# Altium schematic sheet power supply.SchDoc
size A3; SheetNumber: 1; SheetTotal: 5
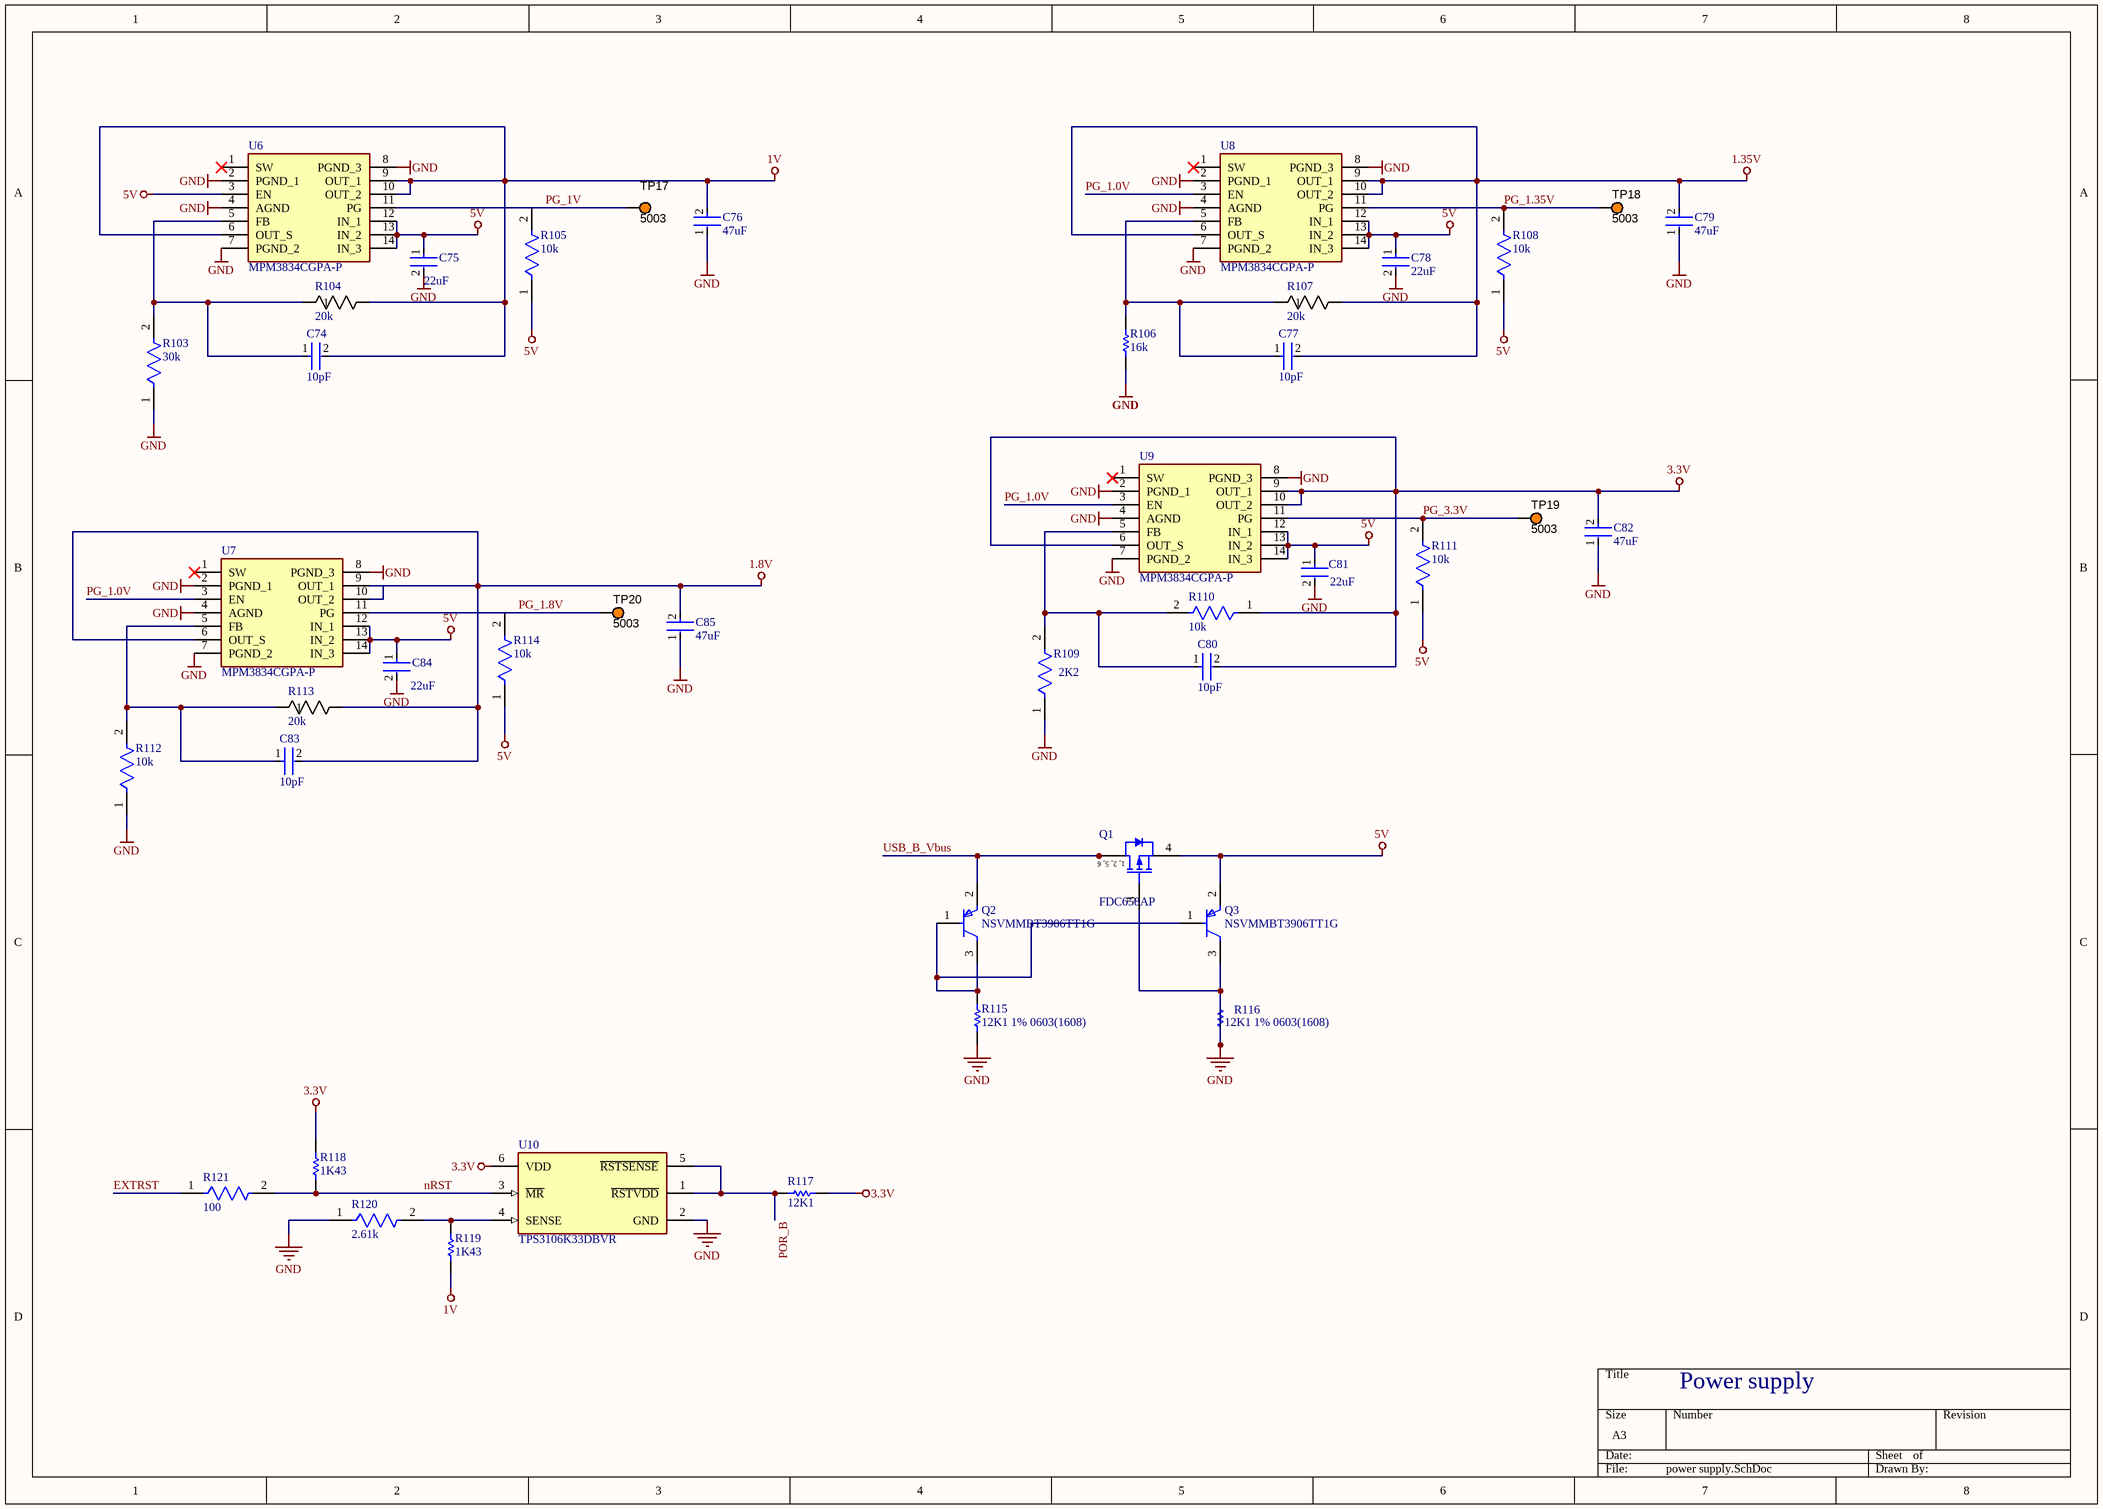
[diagram p0: power supply.SchDoc]

## Parts
C74  10pF  [FP-0603-L_1_6_0_15-W_0_81-IPC_B]
C75  22uF  [FP-GRMJN7-0_1-IPC_C]
C76  47uF  [FP-GRM31C-0_3-e0_3_0_8-IPC_C]
C77  10pF  [FP-0603-L_1_6_0_15-W_0_81-IPC_B]
C78  22uF  [FP-GRMJN7-0_1-IPC_C]
C79  47uF  [FP-GRM31C-0_3-e0_3_0_8-IPC_C]
C80  10pF  [FP-0603-L_1_6_0_15-W_0_81-IPC_B]
C81  22uF  [FP-GRMJN7-0_1-IPC_C]
C82  47uF  [FP-GRM31C-0_3-e0_3_0_8-IPC_C]
C83  10pF  [FP-0603-L_1_6_0_15-W_0_81-IPC_B]
C84  22uF  [FP-GRMJN7-0_1-IPC_C]
C85  47uF  [FP-GRM31C-0_3-e0_3_0_8-IPC_C]
Q1  FDC658AP  [FAIR-SOT23-6_V]
Q2  NSVMMBT3906TT1G  [FP-463-01-MFG]
Q3  NSVMMBT3906TT1G  [FP-463-01-MFG]
R103  30k  [FP-RMCF0603-IPC_A]
R104  20k  [RES_RCC0402_VIS]
R105  10k  [FP-RN73R2A-IPC_A]
R106  16k  [RESC0603X28X15LL05T05]
R107  20k  [RES_RCC0402_VIS]
R108  10k  [FP-RN73R2A-IPC_A]
R109  2K2  [FP-LTR10-IPC_B]
R110  10k  [FP-RN73R2A-IPC_A]
R111  10k  [FP-RN73R2A-IPC_A]
R112  10k  [FP-RN73R2A-IPC_A]
R113  20k  [RES_RCC0402_VIS]
R114  10k  [FP-RN73R2A-IPC_A]
R115  12K1 1% 0603(1608)  [RESC0603(1608)_M]
R116  12K1 1% 0603(1608)  [RESC0603(1608)_M]
R117  12K1  [RESC0603(1608)_M]
R118  1K43  [RESC1206(3216)_M]
R119  1K43  [RESC1206(3216)_M]
R120  2.61k  [FP-RK73H1J-IPC_B]
R121  100  [FP-RMCF0805-IPC_A]
TP17  5003  [KSTN-5003]
TP18  5003  [KSTN-5003]
TP19  5003  [KSTN-5003]
TP20  5003  [KSTN-5003]
U6  MPM3834CGPA-P  [MPM3834CGPAP]
U7  MPM3834CGPA-P  [MPM3834CGPAP]
U8  MPM3834CGPA-P  [MPM3834CGPAP]
U9  MPM3834CGPA-P  [MPM3834CGPAP]
U10  TPS3106K33DBVR  [FP-DBV0006A-MFG]

## Nets
1.8V: C83.2 C85.2 R113.2 U7.6(OUT_S) U7.9(OUT_1) U7.10(OUT_2)
1.35V: C77.2 C79.2 R107.2 U8.6(OUT_S) U8.9(OUT_1) U8.10(OUT_2)
1V: C74.2 C76.2 R104.2 R119.1 U6.6(OUT_S) U6.9(OUT_1) U6.10(OUT_2)
3.3V: C80.2 C82.2 R110.1 R117.1 R118.2 U9.6(OUT_S) U9.9(OUT_1) U9.10(OUT_2) U10.6(VDD)
5V: C75.1 C78.1 C81.1 C84.1 Q1.4(SOURCE) Q3.2(E) R105.1 R108.1 R111.1 R114.1 U6.3(EN) U6.12(IN_1) U6.13(IN_2) U6.14(IN_3) U7.12(IN_1) U7.13(IN_2) U7.14(IN_3) U8.12(IN_1) U8.13(IN_2) U8.14(IN_3) U9.12(IN_1) U9.13(IN_2) U9.14(IN_3)
GND: C75.2 C76.1 C78.2 C79.1 C81.2 C82.1 C84.2 C85.1 Q1.3(GATE) Q3.3(C) R103.1 R106.1 R109.1 R112.1 R115.1 R116.1 R116.2 R120.1 U6.2(PGND_1) U6.4(AGND) U6.7(PGND_2) U6.8(PGND_3) U7.2(PGND_1) U7.4(AGND) U7.7(PGND_2) U7.8(PGND_3) U8.2(PGND_1) U8.4(AGND) U8.7(PGND_2) U8.8(PGND_3) U9.2(PGND_1) U9.4(AGND) U9.7(PGND_2) U9.8(PGND_3) U10.2(GND)
EXTRST: R121.1
nRST: R118.1 R121.2 U10.3(~{MR})
PG_1.0V: U7.3(EN) U8.3(EN) U9.3(EN)
PG_1.8V: R114.2 TP20.1 U7.11(PG)
PG_1.35V: R108.2 TP18.1 U8.11(PG)
PG_1V: R105.2 TP17.1 U6.11(PG)
PG_3.3V: R111.2 TP19.1 U9.11(PG)
POR_B: R117.2 U10.1(~{RSTVDD}) U10.5(~{RSTSENSE})
USB_B_Vbus: Q1.1(DRAIN) Q1.2(DRAIN) Q1.5(DRAIN) Q1.6(DRAIN) Q2.2(E)
NetC74_1: C74.1 R103.2 R104.1 U6.5(FB)
NetC77_1: C77.1 R106.2 R107.1 U8.5(FB)
NetC80_1: C80.1 R109.2 R110.2 U9.5(FB)
NetC83_1: C83.1 R112.2 R113.1 U7.5(FB)
NetQ2_1: Q2.1(B) Q2.3(C) Q3.1(B) R115.2
NetR119_2: R119.2 R120.2 U10.4(SENSE)

Not connected (* = marked no-connect by the designer): U6 1(SW)*; U7 1(SW)*; U8 1(SW)*; U9 1(SW)*

## Notes on the sheet
- Power supply
- (in symbol CMP-2000-06244-1) 1, 2, 5, 6

## Library data of the parts
C74 C77 C80 C83 = CMP-04427-018082-1: General Purpose Ceramic Capacitor, 0603, 10pF, 2%, NP0, 30ppm/°C, 100V; Dielectric: C0G; Package Quantity: 1; Case/Package: 0603; Mount: Surface Mount; Length: 0.063inch; Voltage Rating (DC): 100V; Lead Free: Lead Free; Termination: SMD/SMT; Thickness: 0.035inch; Capacitance: 10pF; Voltage Rating: 100V; Tolerance: 2%; Case Code (Metric): 1608; Max Operating Temperature: 125°C; Height: 860um; Width: 0.032inch; Case Code (Imperial): 0603; Min Operating Temperature: -55°C; Construction: Flat; Number of Pins: 2; Series: -; Packaging: Tape and Reel; RoHS Compliant: Yes
C75 C78 C81 C84 = CMP-06035-032253-1: Chip Multilayer Ceramic Capacitors for General Purpose, 0704, 22uF, X5R, 15%, 20%, 16V
C76 C79 C82 C85 = CMP-06035-011430-1: Chip Multilayer Ceramic Capacitors for General Purpose, 1206, 47uF, X5R, 15%, 20%, 16V; Capacitance: 47uF; Length: 3.2mm; Thickness: 1.6mm; Width: 1.6mm; Voltage Rating (DC): 16V; Tolerance: 20%; Dielectric: X5R
Q1 = CMP-2000-06244-1: Single P-Channel Logic Level PowerTrench(R) MOSFET, -30 V, -4 A, -55 to 150 degC, 6-Pin SOT23, RoHS, Tape and Reel; Manufacturer: Fairchild Semiconductor; Drain-to-Source Voltage [Vdss]: 30V; Qg Gate Charge: 8.1nC; Rated Power Dissipation: 0.8W; Package Version: Rev. 5, 05/2015; Drain-Source On Resistance-Max: 50mO; Datasheet Version: Rev. B1, 11/2011; Channel Type: P-Channel; Package URL: https://www.fairchildsemi.com/package-drawings/MA/MA06A.pdf; Datasheet URL: https://datasheet.ciiva.com/15137/getdatasheetpartid-92299-15137737.pdf; Package Description: 6-Pin Small Outline Transistor, Body 2.9 x 1.6 mm, Pitch 0.95 mm; Mounting Technology: SurfaceMount; Manufacturer URL: https://www.fairchildsemi.com/; Package Reference: SOT23-6
Q2 Q3 = CMP-00278-57605538-1: NSVMMBT3906TT1G Small Signal Bipolar Transistor, 0.2A I(C), 40V V(BR)CEO, 1-Element, PNP, Silicon; Manufacturer Lifecycle Status: ACTIVE; Collector Emitter Voltage (VCEO): 400mV; Transition Frequency: 250MHz; Max Collector Current: 200mA; Max Power Dissipation: 200mW; NexarPartId: 57605538; Packaging: Tape & Reel (TR); Lead Free: Lead Free; Lifecycle Status: Production; Collector Emitter Breakdown Voltage: 40V; Mount: Surface Mount; RoHS: Compliant
R103 = CMP-26527-002251-1: 30kΩ ±5% 0.1W 0603 Thick Film Chip Resistor AEC-Q200 compliant; Max Power Dissipation: 100mW; Temperature Coefficient: 200ppm/°C; Resistance: 30kR; Width: 0.031inch; Series: RMCF; Resistor Type: Thick Film; Number of Terminations: 2; Max Operating Temperature: 155°C; Length: 0.061inch; Contact Plating: Tin; Case/Package: 0603; Height: 0.022inch; Tolerance: 5%; Min Operating Temperature: -55°C; Mount: Surface Mount; Packaging: Tape and Reel; RoHS Compliant: Yes; Features: Automotive AEC-Q200; Radiation Hardening: No
R104 R107 R113 = CMP-05494-108190669-1: RCC040220K0FKED Res Thick Film 0402 20K Ohm 1% 0.125W(1/8W) ±100ppm/°C Pad SMD Automotive T/R; Schedule B: 8533210045; NexarPartId: 108190669
R105 R108 R110-R112 R114 = CMP-04015-052084-1: RES 10K OHM 0.1% 1/8W 0805
R106 = CMP-2004-00154-1: Part Number: CRCW020116K0JNED; Manufacturer: Vishay Dale
R109 = CMP-08839-030356-1: High power chip resistors wide terminal type 2.2kΩ 5% 0.25W 0508; Max Power Dissipation: 250mW; Resistance: 2.2kR; Temperature Coefficient: 200ppm/°C; Tolerance: 5%; Series: LTR; Height: 0.026inch; Case Code (Metric): 2012; Features: Automotive AEC-Q200; Max Operating Temperature: 155°C; Packaging: Tape and Reel; Min Operating Temperature: -55°C; Case/Package: 0805; Resistor Type: Thick Film; Number of Terminations: 2; Width: 0.079inch; Length: 0.047inch; Case Code (Imperial): 0805; Package Quantity: 1
R115-R117 = CMP-1012-00632-1: 12K1 0.1W 1% 0603 (1608 Metric)  SMD; Case-Metric: 1608; Case-EIA: 0603; Value: 12100.00 Ohm; Power: 0.1 W; Technology: SMT; Tolerance: 1 %
R118 R119 = CMP-1014-00526-1: 1K43 0.25W 1% 1206 (3216 Metric)  SMD; Value: 1430.00 Ohm; Case-EIA: 1206; Case-Metric: 3216; Power: 0.25 W; Technology: SMT; Tolerance: 1 %
R120 = CMP-04015-095862-1: 2.61kΩ ±0.5% 0.1W Chip Resistor 0603 Thick Film AEC-Q200 Qualified
R121 = CMP-26527-001731-1: 100Ω ±1% 0.125W 0805 Thick Film Chip Resistor AEC-Q200 compliant; Power Rating: 250mW; Temperature Coefficient: 100ppm/°C; Resistance: 100R; Max Power Dissipation: 125mW; Radiation Hardening: No; RoHS Compliant: Yes; Case Code (Imperial): 0805; Depth: 1.25mm; Length: 2mm; Min Operating Temperature: -55°C; Series: RMCF; Packaging: Tape and Reel; Features: Automotive AEC-Q200; Height: 0.026inch; Size Code: 0805; Tolerance: 1%; Number of Terminations: 2; Max Operating Temperature: 155°C; Case/Package: 0805; Width: 0.049inch; Contact Plating: Tin; Resistor Type: Thick Film; Construction: Rectangular; Lead Free: Lead Free; Military Standard: Not; Case Code (Metric): 2012; Mount: Surface Mount
TP17-TP20 = CMP-1672-00009-1: Test Point, Orange, 1-Pin THD, RoHS; Peak Reverse Current: 600 uA; Forward Current: 3 A; Max Surge Current: 80 A; Forward Voltage: 1.08 V; Max Operating Temperature: 150 degC; PackageReference: 5003; Pins: 2; ComponentLink2URL: http://keyelco.com/userAssets/file/M65p56.pdf; PackageDescription: 1-Pin Through Hole Device, Dia 2.54 mm; Weight: 0.01 lb; Diameter: 5.3 mm; Mount: Through Hole; Package Quantity: 500; Packaging: Bulk; Min Operating Temperature: -65 degC; ComponentLink1Description: Manufacturer URL; Height: 0.25 inch; ComponentLink1URL: http://www.keyelco.com/; ComponentLink2Description: Datasheet; Width: 0.25 inch; REACH SVHC: No SVHC; RoHSCompliant: true; Radiation Hardening: No; Length: 9.5 mm; DatasheetVersion: Jun-15
U6-U9 = MPM3834CGPA-P: Integrated Circuit; Manufacturer_Name: Monolithic Power Systems (MPS); Datasheet Link: https://www.monolithicpower.com/en/documentview/productdocument/index/version/2/document_type/Datasheet/lang/en/sku/MPM3834CGPA/document_id/9651/; Height: 1.31mm; Manufacturer_Part_Number: MPM3834CGPA-P; Mouser Part Number: 946-MPM3834CGPA-P; Mouser Price/Stock: https://www.mouser.co.uk/ProductDetail/Monolithic-Power-Systems-MPS/MPM3834CGPA-P?qs=By6Nw2ByBD1gcNTTHPVSOg%3D%3D
U10 = CMP-04919-000013-1: IC SUPERVISORY CIRCUIT SOT-23-6; Manufacturer: Texas Instruments; Min Supply Voltage: 0.9V; Reset Type: Active Low; Max Junction Temp: +125°C; Reset Timeout: 130ms; Number Of Rails Monitored: 1; Threshold Voltage: 2.941V; Nominal Supply Current: 1.2-2uA; Standoff Height: 0mm; Max Supply Voltage: 3.6V; Number Of Outputs: 2; Temperature Range High: +85°C; Device Class L1: Integrated Circuits (ICs); Device Class L3: Voltage Supervisors; Automotive: No; Mouser Description: Supervisory Circuits Current/Supply-Volt Supervisory; Temperature: -40°C to +85°C; Lead Free: Yes; Height: 1.45mm; Category: IC; Octopart: https://octopart.com/tps3106k33dbvr-texas+instruments-505820; Device Class L2: Power Management ICs; RoHS: TRUE; Package: DBV0006A; ComponentLink2Description: Datasheet; ComponentLink2URL: http://www.ti.com/lit/ds/symlink/tps3106.pdf; Temperature Range Low: -40°C; Digikey Description: IC SUPERVISORY CIRCUIT SOT-23-6; Manufacturer Part Number: TPS3106K33DBVR; Ipc Land Pattern Name: SOT95P280X145-6